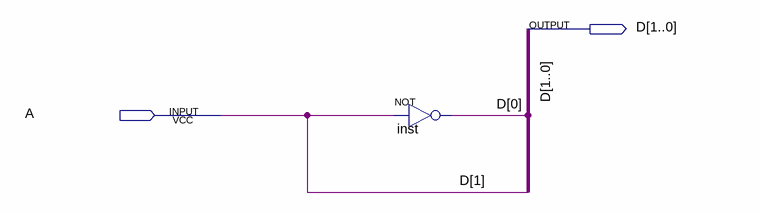
[diagram p0: schematic sheet]
// Quartus schematic first.bdf as structural Verilog: 1 symbols, 2 pins
module first (
  input  A,
  output [1:0] D
);

  not inst (D[0], A);

  assign D[1] = A;
endmodule
